# EAGLE design Controller (EAGLE 7.3.0)
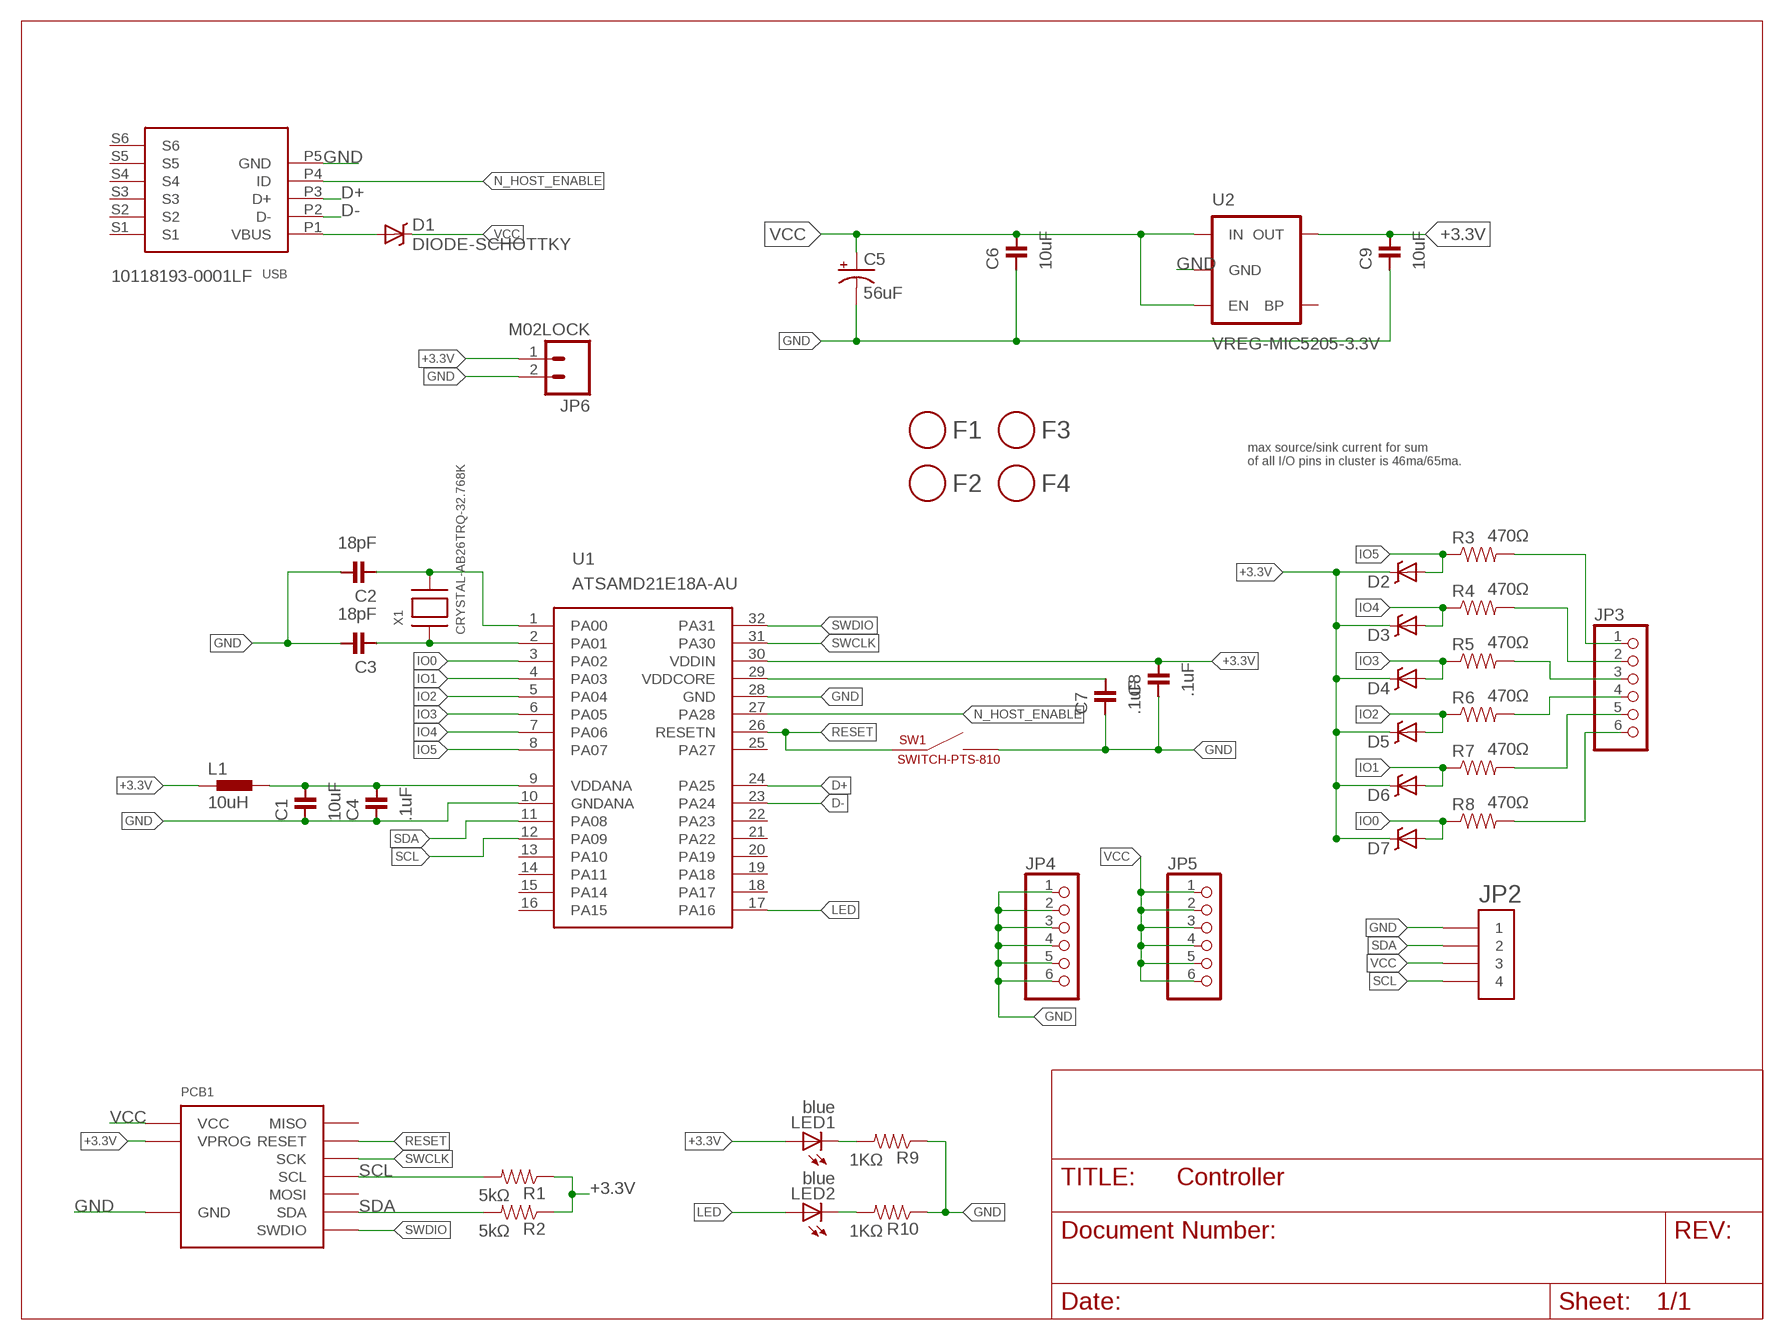
[diagram p0: schematic, sheet 1]
FRAME1 (LETTER_L): BOM: EXCLUDE

## Parts
C1  10uF  CAPACITOR-10UF  [0603]
C2  18pF  CAPACITOR-18PF  [0603]
C3  18pF  CAPACITOR-18PF  [0603]
C4  .1uF  CAPACITOR-.1UF  [0603]
C5  56uF  CAPACITOR-POL-56UF-25V  [PANASONIC_D]
C6  10uF  CAPACITOR-10UF  [0603]
C7  .1uF  CAPACITOR-.1UF  [0603]
C8  .1uF  CAPACITOR-.1UF  [0603]
C9  10uF  CAPACITOR-10UF  [0603]
D1  DIODE-SCHOTTKY  [SMP]
D2  DIODE-SCHOTTKY-BAT60A  [SOD-323]
D3  DIODE-SCHOTTKY-BAT60A  [SOD-323]
D4  DIODE-SCHOTTKY-BAT60A  [SOD-323]
D5  DIODE-SCHOTTKY-BAT60A  [SOD-323]
D6  DIODE-SCHOTTKY-BAT60A  [SOD-323]
D7  DIODE-SCHOTTKY-BAT60A  [SOD-323]
F1  FIDUCIAL  [FIDUCIAL_1MM]
F2  FIDUCIAL  [FIDUCIAL_1MM]
F3  FIDUCIAL  [FIDUCIAL_1MM]
F4  FIDUCIAL  [FIDUCIAL_1MM]
JP1  USBFCI-MICROB  [USB-MICROB-FCI]
JP2  HEADER-1X4-AMPMODU  [AMPMODU-4P]
JP3  PINHD-1X6LOCK  [1X06-BIGLOCK]
JP4  PINHD-1X6LOCK  [1X06-BIGLOCK]
JP5  PINHD-1X6LOCK  [1X06-BIGLOCK]
JP6  M02LOCK  [1X02_LOCK]
L1  10uH  INDUCTOR-10UH  [0603]
LED1  blue  LED-0805-BLUE  [0805-LED]
LED2  blue  LED-0805-BLUE  [0805-LED]
PCB1  DEVICE-PCB  [DEVICE-PCB]
R1  5kΩ  RESISTOR-5KΩ  [0603]
R2  5kΩ  RESISTOR-5KΩ  [0603]
R3  470Ω  RESISTOR-470Ω  [0603]
R4  470Ω  RESISTOR-470Ω  [0603]
R5  470Ω  RESISTOR-470Ω  [0603]
R6  470Ω  RESISTOR-470Ω  [0603]
R7  470Ω  RESISTOR-470Ω  [0603]
R8  470Ω  RESISTOR-470Ω  [0603]
R9  1KΩ  RESISTOR-1KΩ  [0603]
R10  1KΩ  RESISTOR-1KΩ  [0603]
SW1  SWITCH-PTS-810  [TACT-SWITCH-PTS-810]
U1  ATSAMD21E18A-AU  SAMD21E  [TQFP-32]
U2  VREG-MIC5205-3.3V  [SOT23-5]
X1  CRYSTAL-AB26TRQ-32.768K  [CRYSTAL-AB26TRQ]

## Nets
+3.3V: C8.1 C9.1 D2.C D3.C D4.C D5.C D6.C D7.C JP6.1 L1.1 LED1.A PCB1.VPROG R1.1 R2.1 U1.30(VDDIN) U2.5(OUT)
D+: JP1.P3(D+) U1.24(PA25)
D-: JP1.P2(D-) U1.23(PA24)
GND: C1.2 C2.1 C3.1 C4.2 C5.- C6.2 C7.2 C8.2 C9.2 JP1.P5(GND) JP2.P$1 JP2.P$2 JP4.1 JP4.2 JP4.3 JP4.4 JP4.5 JP4.6 JP6.2 PCB1.GND R9.1 R10.1 SW1.P$3(NEG1) SW1.P$4(NEG1) U1.10(GNDANA) U1.28(GND) U2.2(GND)
IO0: D7.A R8.1 U1.3(PA02)
IO1: D6.A R7.1 U1.4(PA03)
IO2: D5.A R6.1 U1.5(PA04)
IO3: D4.A R5.1 U1.6(PA05)
IO4: D3.A R4.1 U1.7(PA06)
IO5: D2.A R3.1 U1.8(PA07)
LED: LED2.A U1.17(PA16)
N$1: LED1.C R9.2
N$2: JP3.1 R3.2
N$3: D1.A JP1.P1(VBUS)
N$4: LED2.C R10.2
N$6: C2.2 U1.1(PA00) X1.XOUT(X2)
N$7: C3.2 U1.2(PA01) X1.XIN(X1)
N$13: JP3.2 R4.2
N$17: JP3.3 R5.2
N$18: JP3.4 R6.2
N$19: JP3.5 R7.2
N$20: JP3.6 R8.2
N$21: C1.1 C4.1 L1.2 U1.9(VDDANA)
N$22: C7.1 U1.29(VDDCORE)
N_HOST_ENABLE: JP1.P4(ID) U1.27(PA28)
RESET: PCB1.RESET SW1.P$1(POS1) SW1.P$2(POS1) U1.26(RESETN)
SCL: JP2.P$7 JP2.P$8 PCB1.SCL R1.2 U1.12(PA09)
SDA: JP2.P$3 JP2.P$4 PCB1.SDA R2.2 U1.11(PA08)
SWCLK: PCB1.CLK(SCK) U1.31(PA30)
SWDIO: PCB1.SWDIO U1.32(PA31)
VCC: C5.+ C6.1 D1.C JP2.P$5 JP2.P$6 JP5.1 JP5.2 JP5.3 JP5.4 JP5.5 JP5.6 PCB1.VCC U2.1(IN) U2.3(EN)
Unconnected: JP1.S1 JP1.S2 JP1.S3 JP1.S4 JP1.S5 JP1.S6 PCB1.MISO PCB1.MOSI U1.13(PA10) U1.14(PA11) U1.15(PA14) U1.16(PA15) U1.18(PA17) U1.19(PA18) U1.20(PA19) U1.21(PA22) U1.22(PA23) U1.25(PA27) U2.4(BP)

## Notes on the sheet
- max source/sink current for sum
  of all I/O pins in cluster is 46ma/65ma.

## Library data of the parts
C1 C6 C9 = Modulo:CAPACITOR: Capacitor; PARTNUM: GRM188R61C106MA73D
C2 C3 = Modulo:CAPACITOR: Capacitor; PARTNUM: C0603C180J5GACTU
C4 C7 C8 = Modulo:CAPACITOR: Capacitor; PARTNUM: C0603C104K5RACTU
C5 = Modulo:CAPACITOR-POL; PARTNUM: EMVA250ADA560MF55G
D1 = Modulo:DIODE-SCHOTTKY; PARTNUM: SS3P3-M3/84A
D2-D7 = Modulo:DIODE-SCHOTTKY; PARTNUM: RB751V40
F1-F4 = Modulo:FIDUCIAL; BOM: EXCLUDE
JP1 = Modulo:USB; PARTNUM: 10118193-0001LF
JP2 = Modulo:HEADER-1X4; PARTNUM: 147721-3
JP3-JP5 = adafruit:PINHD-1X6: PIN HEADER; PARTNUM: M20-9990646
JP6 = SparkFun-Connectors:M02: Standard 2-pin 0.1" header. Use with - straight break away headers ( PRT-00116) - right angle break away headers (PRT-00553) - swiss pins (PRT-00743) - machine pins (PRT-00117) - female headers (PRT-00115) Molex polarized connector foot print use with: PRT-08233 with associated crimp pins and housings. 2.54_SCREWTERM for use with PRT-10571. 3.5mm Screw Terminal footprints for PRT-08084 5mm Screw Terminal footprints for use with PRT-08433; PARTNUM: M20-9990246
L1 = Modulo:INDUCTOR; PARTNUM: BLM18TG102TN1D
LED1 = Modulo:LED: LED; PARTNUM: LTST-C171KRKT
LED2 = Modulo:LED: LED; PARTNUM: LTST-C171TBKT
PCB1 = Modulo:DEVICE-PCB: Modulo Footprint; PARTNUM: Controller PCB
R1 R2 = Modulo:RESISTOR: Resistor Basic schematic elements and footprints for 0603, 1206, and PTH resistors.; PARTNUM: ERJ-3EKF5101V
R3-R8 = Modulo:RESISTOR: Resistor Basic schematic elements and footprints for 0603, 1206, and PTH resistors.; PARTNUM: ERJ-3EKF4700V
R9 R10 = Modulo:RESISTOR: Resistor Basic schematic elements and footprints for 0603, 1206, and PTH resistors.; PARTNUM: ERJ-3EKF1001V
SW1 = Modulo:SWITCH; PARTNUM: PTS810 SJM 250 SMTR LFS
U1 = Modulo:SAMD21E; PARTNUM: ATSAMD21E18A-AUT
U2 = Modulo:VREG-MIC5205: V_REG MIC5219 Standard 3.3V and 5V 150mA LDO voltage regulator in SOT-23 layout. Micrel part MIC5205. BP (by-pass) pin is used to lower output noise with 470pF cap, may be left open.; PARTNUM: MIC5205-3.3YM5 TR
X1 = Modulo:CRYSTAL; PARTNUM: AB26TRQ-32.768KHZ-T

## Board
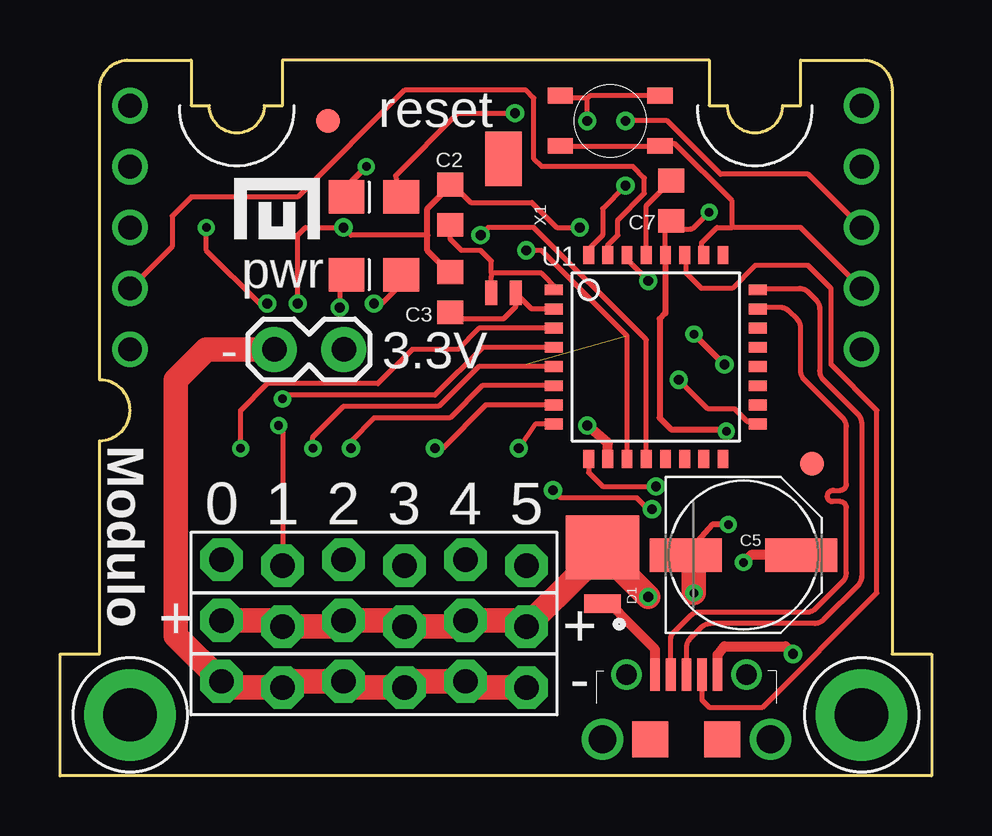
[diagram p1: board, top side]
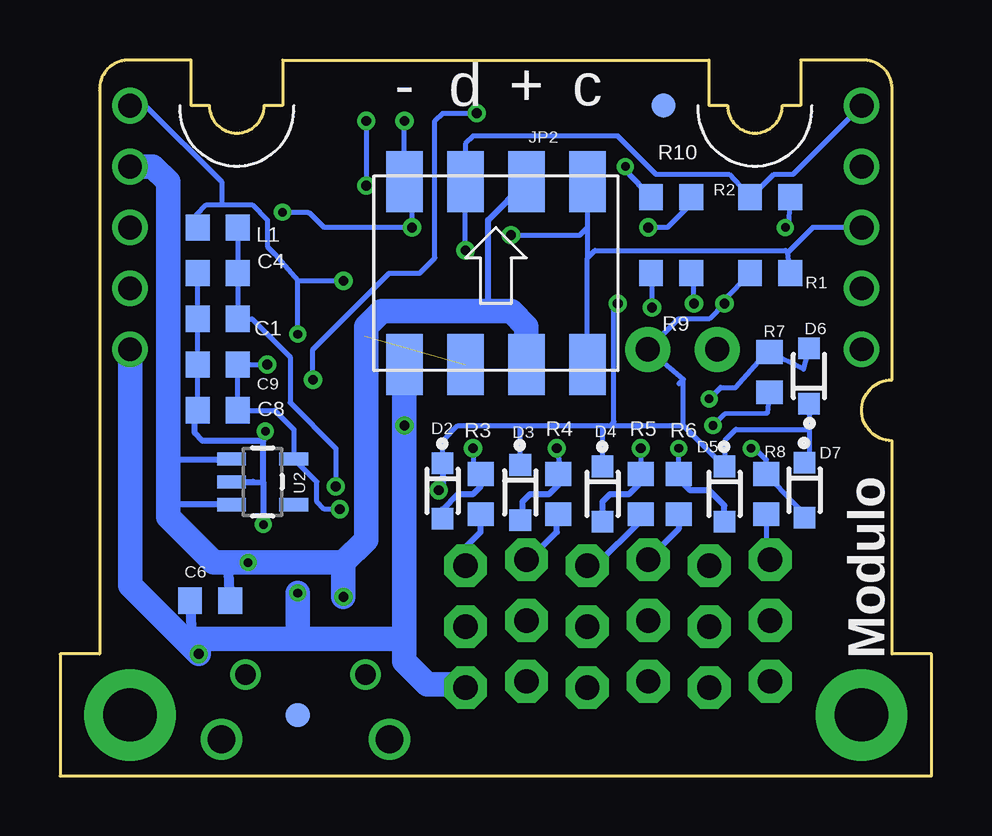
[diagram p2: board, bottom side, seen from below]

Size 36.32 x 29.84 mm. Coordinates in mm from the lower left corner, seen from the top.
Copper layers (1*16): Top 0.0356mm / dielectric 1.5011mm / Bottom 0.0356mm
Design rules "Modulo": minimum track width 6mil, minimum drill 13mil, track to track 6mil, track to pad 6mil, pad to pad 6mil, via to via 6mil, smd to smd 6mil, copper to edge 15mil, drill to drill 6mil, minimum pad ring 7mil, minimum via ring 7mil, stop-mask expansion 3mil, vias tented up to drill 25mil, thermal gap 10mil

### Footprints (pad centres in the part's own frame; a part is rotated, then mirrored left to right if it is on the bottom)
0603 = smd 0.991 x 1.092: 1 -0.838,0; 2 0.838,0
PANASONIC_D = smd 3 x 1.4: + 2.4,0; - -2.4,0
SMP = smd 0.762 x 1.524: A 2.349,0 | smd 2.667 x 3.048: C 0,0
SOD-323 = smd 0.9 x 0.9: A 1.15,0; C -1.15,0
FIDUCIAL_1MM = smd 1 x 1: 1 0,0
USB-MICROB-FCI = smd 0.4 x 1.35: P1 -1.3,2.7; P2 -0.65,2.7; P3 0,2.7; P4 0.65,2.7; P5 1.3,2.7 | drill 0.85: S1 -2.5,2.7; S2 2.5,2.7 | drill 1.15: S3 -3.5,0; S6 3.5,0 | smd 1.5 x 1.5: S4 -1.5,0; S5 1.5,0
AMPMODU-4P = smd 1.524 x 2.54: P$1 -3.81,3.81; P$2 -3.81,-3.81; P$3 -1.27,3.81; P$4 -1.27,-3.81; P$5 1.27,3.81; P$6 1.27,-3.81; P$7 3.81,3.81; P$8 3.81,-3.81
1X06-BIGLOCK = drill 1.016 pad 1.778 octagon: 1 -6.35,0.127; 2 -3.81,-0.127; 3 -1.27,0.127; 4 1.27,-0.127; 5 3.81,0.127; 6 6.35,-0.127
1X02_LOCK = drill 1.016 pad 1.88: 1 -0.178,0; 2 2.718,0
0805-LED = smd 1.397 x 1.499: A 0,-1.143; C 0,1.143
DEVICE-PCB = drill 0.991: CLK 2.54,20.32; GND 33.02,17.78; MISO 2.54,17.78; MOSI 2.54,25.4; RESET 33.02,20.32; SCL 2.54,22.86; SDA 2.54,27.94; SWDIO 33.02,22.86; VCC 33.02,25.4; VPROG 33.02,27.94 | drill 2.223 pad 3.81: P$1 2.54,2.54; P$2 33.02,2.54
TACT-SWITCH-PTS-810 = smd 1.05 x 0.65: P$1 -2.075,1.05; P$2 2.075,1.05; P$3 -2.075,-1.05; P$4 2.075,-1.05
TQFP-32 = smd 0.75 x 0.45: 1 -4.25,2.8; 2 -4.25,2; 3 -4.25,1.2; 4 -4.25,0.4; 5 -4.25,-0.4; 6 -4.25,-1.2; 7 -4.25,-2; 8 -4.25,-2.8; 17 4.25,-2.8; 18 4.25,-2; 19 4.25,-1.2; 20 4.25,-0.4; 21 4.25,0.4; 22 4.25,1.2; 23 4.25,2; 24 4.25,2.8 | smd 0.45 x 0.75: 9 -2.8,-4.25; 10 -2,-4.25; 11 -1.2,-4.25; 12 -0.4,-4.25; 13 0.4,-4.25; 14 1.2,-4.25; 15 2,-4.25; 16 2.8,-4.25; 25 2.8,4.25; 26 2,4.25; 27 1.2,4.25; 28 0.4,4.25; 29 -0.4,4.25; 30 -1.2,4.25; 31 -2,4.25; 32 -2.8,4.25
SOT23-5 = smd 0.55 x 1.2: 1 -0.95,-1.3; 2 0,-1.3; 3 0.95,-1.3; 4 0.95,1.3; 5 -0.95,1.3
CRYSTAL-AB26TRQ = smd 2.286 x 1.524: P$1 -3.175,0 | smd 1.016 x 0.508: XIN 2.413,0.508; XOUT 2.413,-0.508

### Placement (x,y rotation side)
C1  29.75,19.05 180 bottom
C2  16.26,23.81 270 top
C3  16.26,20.16 270 top
C4  29.75,20.95 180 bottom
C5  28.48,9.21 0 top
C6  30.07,7.3 180 bottom
C7  25.46,23.97 270 top
C8  29.75,15.24 180 bottom
C9  29.75,17.14 180 bottom
D1  22.61,9.53 270 top
D2  20.38,11.87 270 bottom
D3  17.14,11.81 270 bottom
D4  13.72,11.75 270 bottom
D5  8.64,11.75 270 bottom
D6  5.11,16.67 90 bottom
D7  5.3,11.91 270 bottom
F1  11.18,27.3 0 top
F2  31.34,13.02 0 top
F3  11.18,27.94 0 bottom
F4  26.42,2.54 0 bottom
JP1  26.1,1.52 0 top
JP2  18.16,20.95 0 bottom
JP3  13.08,8.89 180 top
JP4  13.08,3.81 0 top
JP5  13.08,6.35 0 top
JP6  11.65,17.78 180 top
L1  29.75,22.86 0 bottom
LED1  13.08,20.89 90 top
LED2  13.08,24.13 90 top
PCB1  0.38,0 0 top
R1  6.73,20.95 0 bottom
R2  6.73,24.13 180 bottom
R3  18.8,11.75 270 bottom
R4  15.56,11.75 270 bottom
R5  12.13,11.75 270 bottom
R6  10.54,11.75 270 bottom
R7  6.76,16.83 270 bottom
R8  6.89,11.75 270 bottom
R9  10.86,20.95 180 bottom
R10  10.86,24.13 180 bottom
SW1  22.92,27.3 180 top
U1  24.83,17.46 0 top
U2  27.88,12.26 270 bottom
U$2  [LOGO-TINY]  8.79,22.38 0 top
X1  18.48,22.54 270 top

### Tracks (layer width: path | path; a pad name or v marks a point on that pad's centre or on a via)
+3.3V  (via drill 0.36, 0.41)
  Top 0.203: v13.08,19.68 13.4,19.68 14.03,20.32 14.46,20.69 LED1.A | U1.30 23.63,21.52 v24.51,20.64 | v24.67,11.11 24.51,11.11 24.04,11.59 20.86,11.59 v20.54,11.91 | v8.64,19.68 8.32,19.68 6.1,21.91 v6.1,22.86
  Top 0.254: v27.69,17.14 v26.42,18.41
  Bottom 0.203: 7.37,20.86 R1.1 8.64,19.81 v8.64,19.68 9.27,19.05 10.56,19.05 JP6.1 10.34,16.53 | C9.1 C8.1 27.37,15.24 26.58,14.45 U2.5 25.62,12.25 25.62,11.43 25.3,11.11 v24.67,11.11 | C9.1 29.27,17.14 | L1.1 30.63,23.41 30.23,23.81 29.59,23.81 | 29.59,23.81 28.32,23.81 27.69,23.18 27.69,22.07 27.37,21.75 26.42,20.64 | 26.42,20.64 v24.51,20.64 | C9.1 v27.69,17.14 | D2.C 20.38,13.97 19.75,14.61 17.21,14.61 | 17.21,14.61 13.72,14.61 | D4.C 13.72,14.61 | D3.C 17.14,14.54 17.21,14.61 | v13.08,19.68 13.24,19.53 13.24,14.76 13.4,14.61 | PCB1.VPROG 32.77,27.94 29.59,24.77 29.59,23.81 | v26.42,18.41 26.42,20.64 | 13.72,14.61 13.4,14.61 | 13.4,14.61 10.34,14.61 | 10.34,14.61 D5.C 8.6,12.86 8.6,14.01 8.16,14.45 5.11,14.45 | 10.34,14.61 10.34,16.53 | 10.52,16.35 10.34,16.53 | D6.C 5.11,14.45 | 5.11,14.45 5.11,13.25 D7.C | R2.1 5.97,22.99 v6.1,22.86
  Bottom 0.254: D2.C 20.38,12.06 v20.54,11.91
D+
  Top 0.203: U1.24 arc-90 29.14,20.32 30.81,20.32 arc-45 31.17,20.17 31.51,19.83 arc-45 31.66,19.48 31.66,16.88 arc45 31.8,16.52 33.25,15.07 arc-45 33.4,14.71 33.4,8.31 arc-45 33.25,7.95 31.8,6.5 arc-45 31.44,6.35 27.1,6.35 arc45 26.74,6.2 26.25,5.71 arc45 26.1,5.35 JP1.P3
D-
  Top 0.203: 29.17,19.37 arc-90 U1.23 29.14,19.53 30.02,19.53 arc-45 30.38,19.38 30.71,19.04 arc-45 30.86,18.68 30.86,16.88 arc45 31.01,16.52 32.62,14.91 arc-45 32.77,14.55 32.77,12.16 arc-90 32.51,11.91 32.23,11.91 arc90 31.97,11.65 arc90 32.2,11.43 32.51,11.43 arc-90 32.77,11.18 32.77,8.46 arc-45 32.62,8.11 31.49,6.97 arc-45 31.13,6.83 26.63,6.83 arc45 26.27,6.68 25.52,5.93 arc45 25.45,5.75 JP1.P2
GND  (via drill 0.36, 0.41)
  Top 0.203: 15.3,22.54 12.13,22.54 v11.81,22.86 10.22,22.86 9.91,22.54 v9.91,19.68 | C2.1 16.41,24.61 17.12,23.9 19.66,23.9 20.7,22.86 v21.65,22.86 | v21.97,27.3 21.97,28.26 | 21.97,28.26 20.63,28.26 SW1.P$4 | SW1.P$3 22.07,28.36 21.97,28.26 | U1.28 25.23,22.79 | 25.23,22.79 arc-45 25.3,22.97 C7.2 | 25.23,22.79 26.24,22.79 arc45 26.42,22.87 v27.05,23.5
  Top 0.254: C3.1 16.17,21.05 15.3,21.91 15.3,22.54 15.3,23.65 16.1,24.45 16.17,24.45 C2.1 | v27.84,10.48 27.19,10.48 C5.- | U1.28 25.23,19.29 24.99,19.05 24.99,14.92 25.46,14.45 27.69,14.45 v27.77,14.37
  Top 0.406: U1.10 22.83,13.88 v21.97,14.61 | JP1.P5 27.4,5.05 27.69,5.4 30.23,5.4 v30.54,5.08
  Top 1.016: JP4.6 17.14,3.68 JP4.5 14.61,3.94 JP4.4 12.06,3.68 JP4.3 9.53,3.94 JP4.2 6.99,3.68 JP4.1 4.83,5.84 4.83,16.51 6.1,17.78 JP6.2 | v26.42,7.62 26.42,8.61 arc45 26.34,8.79 C5.-
  Bottom 0.203: v9.91,19.68 9.91,20.73 R9.1 | v21.97,27.3 JP2.P$1 21.65,24.13 v21.65,22.86 25.3,22.86 25.87,23.42 arc-45 26.05,23.5 v27.05,23.5 | C8.2 C9.2 C1.2 C4.2 | R10.1 10.1,23.78 11.02,22.86 v11.81,22.86
  Bottom 0.254: U2.2 28.29,12.26 27.84,12.22 | 27.84,12.22 27.84,13.97 | 27.84,13.97 30.39,13.97 30.7,14.29 30.7,15.21 C8.2 | 27.84,12.22 v27.84,10.48 | 27.84,13.97 v27.77,14.37
  Bottom 0.406: v30.54,5.08 30.86,5.71 30.23,5.71 | 30.23,5.71 29.27,5.71 | C6.2 30.83,5.84 30.23,5.71
  Bottom 1.016: JP2.P$2 v21.97,14.61 21.97,5.71 | 19.56,3.81 21.02,3.81 21.97,4.76 21.97,5.71 | 21.97,5.71 26.42,5.71 | 26.42,5.71 30.23,5.71 30.54,5.71 v30.54,5.08 33.4,7.94 PCB1.GND | 26.42,5.71 v26.42,7.62
  Bottom 1.422: 19.56,3.81 JP4.6
IO0  (via drill 0.36)
  Top 0.203: U1.3 17.46,18.66 16.57,17.78 14.67,17.78 13.24,16.35 8.64,16.35 7.53,15.24 v7.53,13.65
  Bottom 0.203: D7.A 5.3,10.92 R8.1 6.89,13.18 7.37,13.65 v7.53,13.65
IO1  (via drill 0.36)
  Top 0.203: U1.4 17.61,17.86 15.62,15.88 9.43,15.88 v9.27,15.72
  Bottom 0.203: v9.27,15.72 8.79,16.19 8.16,16.19 6.89,17.62 R7.1 5.34,16.95 D6.A
IO2  (via drill 0.36)
  Top 0.203: U1.5 17.44,17.06 15.78,15.4 11.81,15.4 10.54,14.13 v10.54,13.65
  Bottom 0.203: R6.1 v10.54,13.65
  Bottom 0.254: D5.A 8.64,11.27 9.27,11.91 10.06,11.91 10.54,12.38 R6.1
IO3  (via drill 0.41)
  Top 0.203: U1.6 17.6,16.26 16.26,14.92 13.08,14.92 12.13,13.97 v12.13,13.65
  Bottom 0.203: v12.13,13.65 R5.1
  Bottom 0.254: D4.A 13.72,10.92 13.72,11.43 13.4,11.75 12.61,11.75 12.13,12.22 R5.1
IO4  (via drill 0.41)
  Top 0.203: U1.7 17.75,15.46 15.94,13.65 v15.62,13.65
  Bottom 0.203: v15.62,13.65 15.47,12.7 R4.1
  Bottom 0.254: D3.A 16.99,10.76 17.05,10.79 17.05,11.43 16.73,11.75 15.94,11.75 15.56,12.13 R4.1
IO5  (via drill 0.41)
  Top 0.203: U1.8 19.81,14.66 v19.11,13.65
  Bottom 0.203: v19.11,13.65 19.11,12.85
  Bottom 0.254: 19.11,12.85 R3.1 18.8,12.06 19.11,11.75 19.75,11.75 20.38,11.11 D2.A
LED  (via drill 0.41)
  Top 0.203: LED2.A 13.98,25.03 16.57,27.62 v18.96,27.62 | U1.17 28.64,14.76 28.11,15.3 26.99,15.3 v25.78,16.51
  Bottom 0.203: v25.78,16.51 25.78,17.78 22.61,20.95 21.34,20.95 20.7,21.59 20.7,27.3 20.38,27.62 v18.96,27.62
N$1  (via drill 0.41)
  Top 0.203: LED1.C 12.02,21.01 11.78,20.85 arc45 11.65,20.32 v11.65,19.53
  Bottom 0.203: v11.65,19.53 11.65,20.8 11.49,20.86 R9.2
N$2
  Bottom 0.254: JP3.1 19.43,9.53 18.8,10.16 R3.2
N$3
  Top 0.406: JP1.P1 24.8,5.27 23.88,6.19 22.8,7.3 D1.A
N$4  (via drill 0.36)
  Top 0.254: LED2.C 12.18,24.82 v12.76,25.4
  Bottom 0.254: v12.76,25.4 12.76,25.27 R10.2
N$6
  Top 0.203: X1.XOUT 17.97,20.83 17.97,20.95 | 17.97,20.95 17.97,21.46 17.53,21.91 16.73,21.91 16.26,22.38 16.26,22.54 16.17,22.7 | 20.7,20.32 20.07,20.95 17.97,20.95
  Top 0.254: 16.17,22.7 C2.2 | U1.1 20.64,20.26 20.7,20.32
N$7
  Top 0.203: U1.2 19.65,19.46 X1.XIN 18.99,19.56 18.48,19.05 16.03,19.05
  Top 0.254: 16.03,19.05 C3.2
N$13
  Bottom 0.254: JP3.2 16.76,9.02 15.62,10.16 15.62,10.92 R4.2
N$17
  Bottom 0.254: 12.22,11.11 R5.2 12.13,10.64 14,8.76 JP3.3
N$18
  Bottom 0.254: R6.2 10.54,10.29 JP3.4
N$19  (via drill 0.36)
  Top 0.203: v9.11,14.61 9.27,14.45 JP3.5
  Bottom 0.203: R7.2 6.86,15.11 8.64,15.08 v9.11,14.61
N$20
  Bottom 0.203: R8.2 6.89,9.18 JP3.6
N$21  (via drill 0.41)
  Top 0.203: U1.9 22.03,12.64 22.61,12.06 v24.83,12.06
  Bottom 0.203: L1.2 C4.1 C1.1 28.32,19.05 26.73,17.46 26.73,15.56 24.83,13.65 v24.83,12.06
N$22
  Top 0.203: U1.29 24.43,23.77 C7.1
N_HOST_ENABLE
  Top 0.203: JP1.P4 26.75,3.16 27.05,2.86 29.27,2.86 34.04,7.62 34.04,15.24 32.13,17.14 32.13,20.32 31.18,21.27 28.96,21.27 28,20.32 26.73,20.32 26.1,20.95 26.1,21.64 U1.27
RESET
  Top 0.203: SW1.P$2 SW1.P$1 24.78,26.35 25.62,26.35 28,23.97 28,22.86 | U1.26 26.73,21.91 26.73,22.23 27.37,22.86 28,22.86 | PCB1.RESET 30.86,22.86 28,22.86
SCL  (via drill 0.41)
  Top 0.203: U1.12 24.43,18.18 19.75,22.86 17.84,22.86 v17.53,22.54
  Bottom 0.203: JP2.P$8 14.35,21.59 | 14.35,21.59 14.03,21.91 6.1,21.91 6.01,21.82 | R1.2 6.01,21.82 | JP2.P$7 14.35,22.86 | 14.35,22.86 14.35,21.59 | v17.53,22.54 14.67,22.54 14.35,22.86 | PCB1.SCL 4.96,22.86 6.01,21.82
SDA  (via drill 0.41)  (1 unrouted)
  Top 0.203: U1.11 23.63,18.34 20.07,21.91 v19.43,21.91
  Bottom 0.203: v19.43,21.91 JP2.P$3 19.43,26.35 19.11,26.67 13.08,26.67 11.49,25.08 8.45,25.08 R2.2 7.49,24.16 6.57,25.08 5.78,25.08 PCB1.SDA
SWCLK
  Top 0.203: U1.31 22.83,22.13 23.24,22.54 23.24,23.18 24.35,24.29 24.35,24.92 23.88,25.4 20.07,25.4 19.75,25.72 19.75,28.26 19.43,28.57 14.35,28.57 9.91,24.13 5.46,24.13 4.67,23.34 4.67,22.07 PCB1.CLK
SWDIO  (via drill 0.41)
  Top 0.203: v23.56,27.3 25.3,27.3 27.53,25.08 31.18,25.08 PCB1.SWDIO | v23.56,24.61 22.61,23.65 22.61,22.54 22.03,21.96 U1.32
  Bottom 0.203: v23.56,27.3 v23.56,24.61
VCC  (via drill 0.36, 0.41)
  Top 0.254: 19.18,6.48 19.3,6.48 19.43,6.35
  Top 0.406: D1.C 22.29,9.37 | C5.+ 28.8,9.21 v28.48,8.89
  Top 1.016: JP5.1 9.02,6.48 JP5.2 11.56,6.22 JP5.3 14.1,6.48 JP5.4 16.64,6.22 JP5.5 19.18,6.48 JP5.6 21.78,8.57 D1.C 22.61,9.47 arc45 22.68,9.29 v24.51,7.46 | 19.75,6.35 19.56,6.35
  Top 1.422: 19.56,6.35 JP5.6
  Bottom 0.203: 23.78,9.94 23.56,10.16 | 29.15,13.18 U2.1
  Bottom 0.254: 18.48,19.37 18.48,23.18 JP2.P$5 | U2.3 31.69,11.31 31.81,11.43 | 29.15,13.18 31.81,13.18
  Bottom 0.406: C6.1 29.3,8.86 28.8,8.89
  Bottom 1.016: JP2.P$6 16.89,18.73 17.53,19.37 18.48,19.37 22.92,19.37 23.56,18.73 23.56,10.16 23.56,9.84 24.51,8.89 | PCB1.VCC 32.45,25.4 31.81,24.77 31.81,13.18 31.81,11.43 31.81,10.79 29.91,8.89 28.8,8.89 v28.48,8.89 24.51,8.89 | v24.51,7.46 24.51,8.89

### Text on the board
tPlace: reset | pwr | - | 3.3V | 0 | 1 | 2 | 3 | 4 | 5 | + | + | -